# EAGLE design xPi (EAGLE 8.6.0)
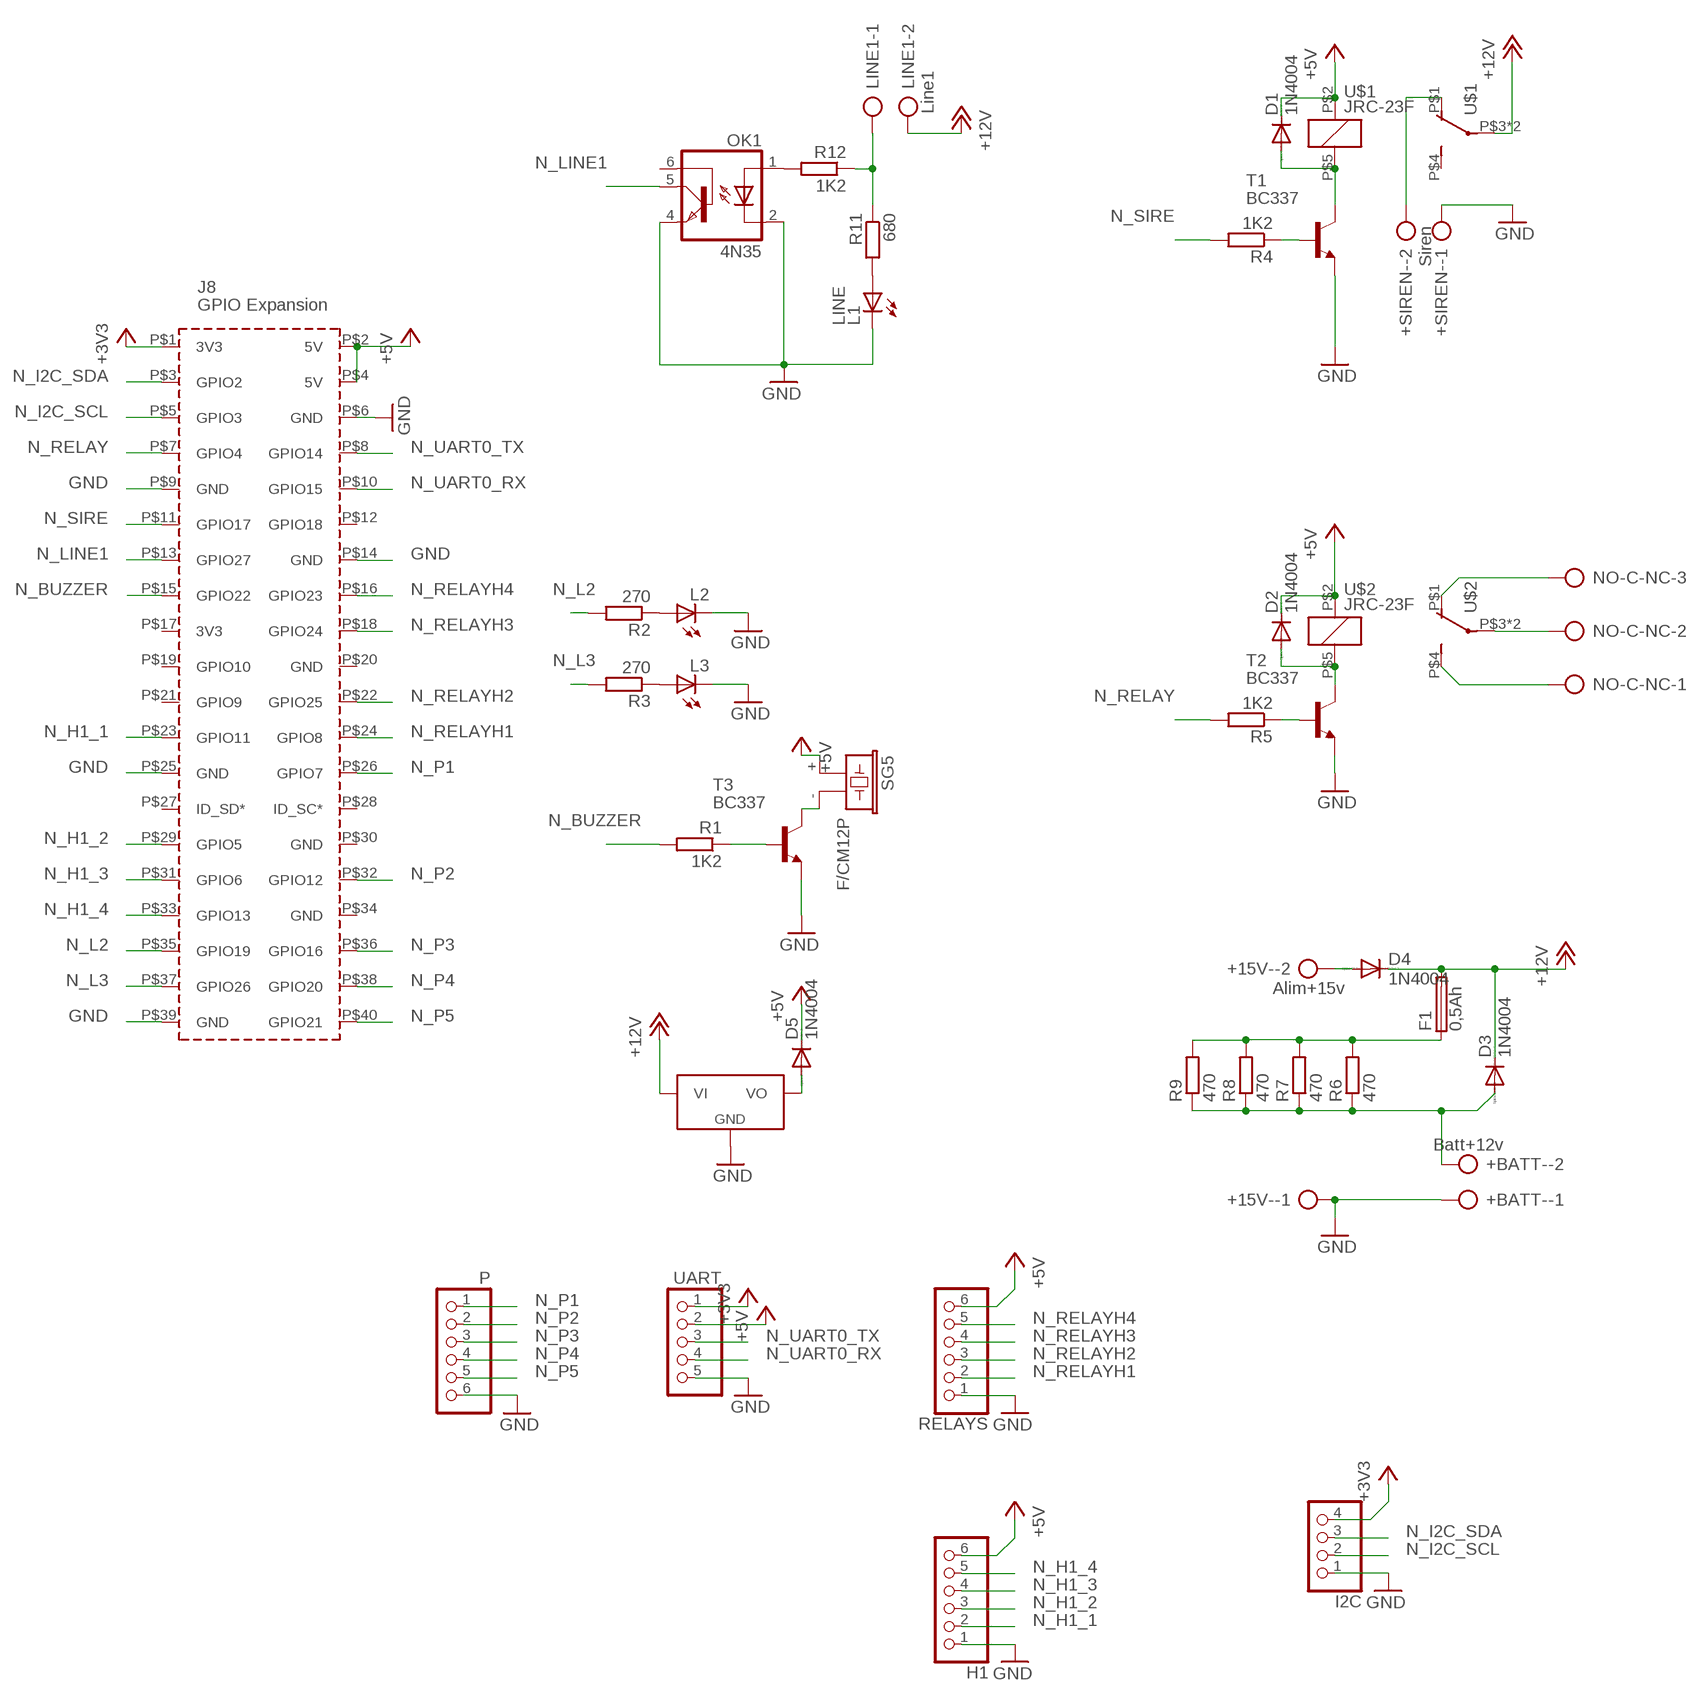
[diagram p0: schematic, sheet 1]

## Parts
+15V-  Alim+15v  AK300/2  [AK300/2]
+BATT-  Batt+12v  AK300/2  [AK300/2]
+SIREN-  Siren  AK300/2  [AK300/2]
D1  1N4004  [DO41-10]
D2  1N4004  [DO41-10]
D3  1N4004  [DO41-10]
D4  1N4004  [DO41-10]
D5  1N4004  [DO41-10]
F1  0,5Ah  FUSEKS9V  [KS9V]
H1  PINHD-1X6  [1X06]
I2C  PINHD-1X4  [1X04]
L1  LINE  LED3MM  [LED3MM]
L2  LED3MM  [LED3MM]
L3  LED3MM  [LED3MM]
LINE1  Line1  AK300/2  [AK300/2]
NO-C-NC  AK300/3  [AK300/3]
OK1  4N35  [DIL06]
P  PINHD-1X6  [1X06]
R1  1K2  R-EU_0204/7  [0204/7]
R2  270  R-EU_0204/7  [0204/7]
R3  270  R-EU_0204/7  [0204/7]
R4  1K2  R-EU_0204/2V  [0204V]
R5  1K2  R-EU_0204/2V  [0204V]
R6  470  R-EU_0204/7  [0204/7]
R7  470  R-EU_0204/7  [0204/7]
R8  470  R-EU_0204/7  [0204/7]
R9  470  R-EU_0204/7  [0204/7]
R11  680  R-EU_0204/7  [0204/7]
R12  1K2  R-EU_0204/7  [0204/7]
RELAYS  PINHD-1X6  [1X06]
SG5  F/CM12P  [F/CM12P]
T1  BC337  [TO92]
T2  BC337  [TO92]
T3  BC337  [TO92]
U$1  JRC-23F  [JRC-23F]
U$2  JRC-23F  [JRC-23F]
U$5  DSWY2596  [DSWY2596]
U$6  RPI3_2  [RPI3_2]
UART  PINHD-1X5  [1X05]

## Nets
+3V3: I2C.4 U$6.P$1(3V3) UART.1
+5V: D1.C D2.C D5.C H1.6 RELAYS.6 SG5.+ U$1.P$2 U$2.P$2 U$6.P$2(5V) U$6.P$4(5V) UART.2
+12V: D3.C D4.C F1.2 LINE1.2 U$1.P$3(P) U$1.P$6(P) U$5.VI
GND: +15V-.1 +BATT-.1 +SIREN-.1 H1.1 I2C.1 L1.K(C) L2.K(C) L3.K(C) OK1.2(C) OK1.4(EMI) P.6 RELAYS.1 T1.1(E) T2.1(E) T3.1(E) U$5.GNDI(GND) U$5.GNDO(GND) U$6.P$6(GND) U$6.P$9(GND) U$6.P$14(GND) U$6.P$25(GND) U$6.P$39(GND) UART.5
N$1: LINE1.1 R11.1 R12.1
N$2: OK1.1(A) R12.2
N$3: R5.1 T2.2(B)
N$4: SG5.- T3.3(C)
N$5: NO-C-NC.1 U$2.P$4(S)
N$6: L2.A R2.1
N$7: R4.1 T1.2(B)
N$8: +15V-.2 D4.A
N$9: D5.A U$5.VO
N$10: R1.1 T3.2(B)
N$11: +SIREN-.2 U$1.P$1(O)
N$12: +BATT-.2 D3.A R6.1 R7.1 R8.1 R9.1
N$13: NO-C-NC.3 U$2.P$1(O)
N$14: NO-C-NC.2 U$2.P$3(P) U$2.P$6(P)
N$15: D2.A T2.3(C) U$2.P$5
N$16: F1.1 R6.2 R7.2 R8.2 R9.2
N$17: D1.A T1.3(C) U$1.P$5
N$21: L1.A R11.2
N$23: L3.A R3.1
N_BUZZER: R1.2 U$6.P$15(GPIO22)
N_H1_1: H1.2 U$6.P$23(GPIO11)
N_H1_2: H1.3 U$6.P$29(GPIO5)
N_H1_3: H1.4 U$6.P$31(GPIO6)
N_H1_4: H1.5 U$6.P$33(GPIO13)
N_I2C_SCL: I2C.2 U$6.P$5(GPIO3)
N_I2C_SDA: I2C.3 U$6.P$3(GPIO2)
N_L2: R2.2 U$6.P$35(GPIO19)
N_L3: R3.2 U$6.P$37(GPIO26)
N_LINE1: OK1.5(COL) U$6.P$13(GPIO27)
N_P1: P.1 U$6.P$26(GPIO7)
N_P2: P.2 U$6.P$32(GPIO12)
N_P3: P.3 U$6.P$36(GPIO16)
N_P4: P.4 U$6.P$38(GPIO20)
N_P5: P.5 U$6.P$40(GPIO21)
N_RELAY: R5.2 U$6.P$7(GPIO4)
N_RELAYH1: RELAYS.2 U$6.P$24(GPIO8)
N_RELAYH2: RELAYS.3 U$6.P$22(GPIO25)
N_RELAYH3: RELAYS.4 U$6.P$18(GPIO24)
N_RELAYH4: RELAYS.5 U$6.P$16(GPIO23)
N_SIRE: R4.2 U$6.P$11(GPIO17)
N_UART0_RX: U$6.P$10(GPIO15) UART.4
N_UART0_TX: U$6.P$8(GPIO14) UART.3
Unconnected: OK1.6(BAS) U$1.P$4(S) U$6.P$12(GPIO18) U$6.P$17(3V3) U$6.P$19(GPIO10) U$6.P$20(GND) U$6.P$21(GPIO9) U$6.P$27(ID_SD*) U$6.P$28(ID_SC*) U$6.P$30(GND) U$6.P$34(GND)

## Library data of the parts
+15V- +BATT- +SIREN- LINE1 = con-ptr500:AK300/2: CONNECTOR; OC_FARNELL: unknown; OC_NEWARK: unknown
D1-D5 = diode:1N4004: DIODE general purpose rectifier, 1 A
F1 = fuse:FUSE: Fuse; OC_FARNELL: unknown; OC_NEWARK: unknown
H1 P RELAYS = pinhead:PINHD-1X6: PIN HEADER
I2C = pinhead:PINHD-1X4: PIN HEADER
L1-L3 = led:LED: LED OSRAM: - CHIPLED LG R971, LG N971, LY N971, LG Q971, LY Q971, LO R971, LY R971 LH N974, LH R974 LS Q976, LO Q976, LY Q976 LO Q996 - Hyper CHIPLED LW Q18S LB Q993, LB Q99A, LB R99A - SideLED LS A670, LO A670, LY A670, LG A670, LP A670 LB A673, LV A673, LT A673, LW A673 LH A674 LY A675 LS A676, LA A676, LO A676, LY A676, LW A676 LS A679, LY A679, LG A679 - Hyper Micro SIDELED® LS Y876, LA Y876, LO Y876, LY Y876 LT Y87S - SmartLED LW L88C, LW L88S LB L89C, LB L89S, LG L890 LS L89K, LO L89K, LY L89K LS L896, LA L896, LO L896, LY L896 - TOPLED LS T670, LO T670, LY T670, LG T670, LP T670 LSG T670, LSP T670, LSY T670, LOP T670, LYG T670 LG T671, LOG T671, LSG T671 LB T673, LV T673, LT T673, LW T673 LH T674 LS T676, LA T676, LO T676, LY T676, LB T676, LH T676, LSB T676, LW T676 LB T67C, LV T67C, LT T67C, LS T67K, LO T67K, LY T67K, LW E67C LS E67B, LA E67B, LO E67B, LY E67B, LB E67C, LV E67C, LT E67C LW T67C LS T679, LY T679, LG T679 LS T770, LO T770, LY T770, LG T770, LP T770 LB T773, LV T773, LT T773, LW T773 LH T774 LS E675, LA E675, LY E675, LS T675 LS T776, LA T776, LO T776, LY T776, LB T776 LHGB T686 LT T68C, LB T68C - Hyper Mini TOPLED® LB M676 - Mini TOPLED Santana® LG M470 LS M47K, LO M47K, LY M47K Source: http://www.osram.convergy.de LUXEON: - LUMILED® LXK2-PW12-R00, LXK2-PW12-S00, LXK2-PW14-U00, LXK2-PW14-V00 LXK2-PM12-R00, LXK2-PM12-S00, LXK2-PM14-U00 LXK2-PE12-Q00, LXK2-PE12-R00, LXK2-PE12-S00, LXK2-PE14-T00, LXK2-PE14-U00 LXK2-PB12-K00, LXK2-PB12-L00, LXK2-PB12-M00, LXK2-PB14-N00, LXK2-PB14-P00, LXK2-PB14-Q00 LXK2-PR12-L00, LXK2-PR12-M00, LXK2-PR14-Q00, LXK2-PR14-R00 LXK2-PD12-Q00, LXK2-PD12-R00, LXK2-PD12-S00 LXK2-PH12-R00, LXK2-PH12-S00 LXK2-PL12-P00, LXK2-PL12-Q00, LXK2-PL12-R00 Source: www.luxeon.com KINGBRIGHT: KA-3528ASYC Source: www.kingbright.com
NO-C-NC = con-ptr500:AK300/3: CONNECTOR; OC_FARNELL: unknown; OC_NEWARK: unknown
OK1 = optocoupler:4N35: MOTOROLA OPTO COUPLER; MF: FAIRCHILD SEMICONDUCTOR; MPN: 4N35; OC_FARNELL: 1328375; OC_NEWARK: 72K9946
R1-R5 R11 R12 = resistor:R-EU_: RESISTOR, European symbol
R6-R9 = rcl:R-EU_: RESISTOR, European symbol; SPICEPREFIX: R
SG5 = buzzer:F/CM12P: BUZZER Source: Buerklin; OC_FARNELL: unknown; OC_NEWARK: unknown
T1-T3 = transistor:BC337: NPN TRANSISTOR
U$1 U$2 = JRC-23F:JRC-23F
U$5 = DSWY2596:DSWY2596
U$6 = e14_Rpi3_RevA+mirror-pcb:RPI3_2
UART = pinhead:PINHD-1X5: PIN HEADER

## Board
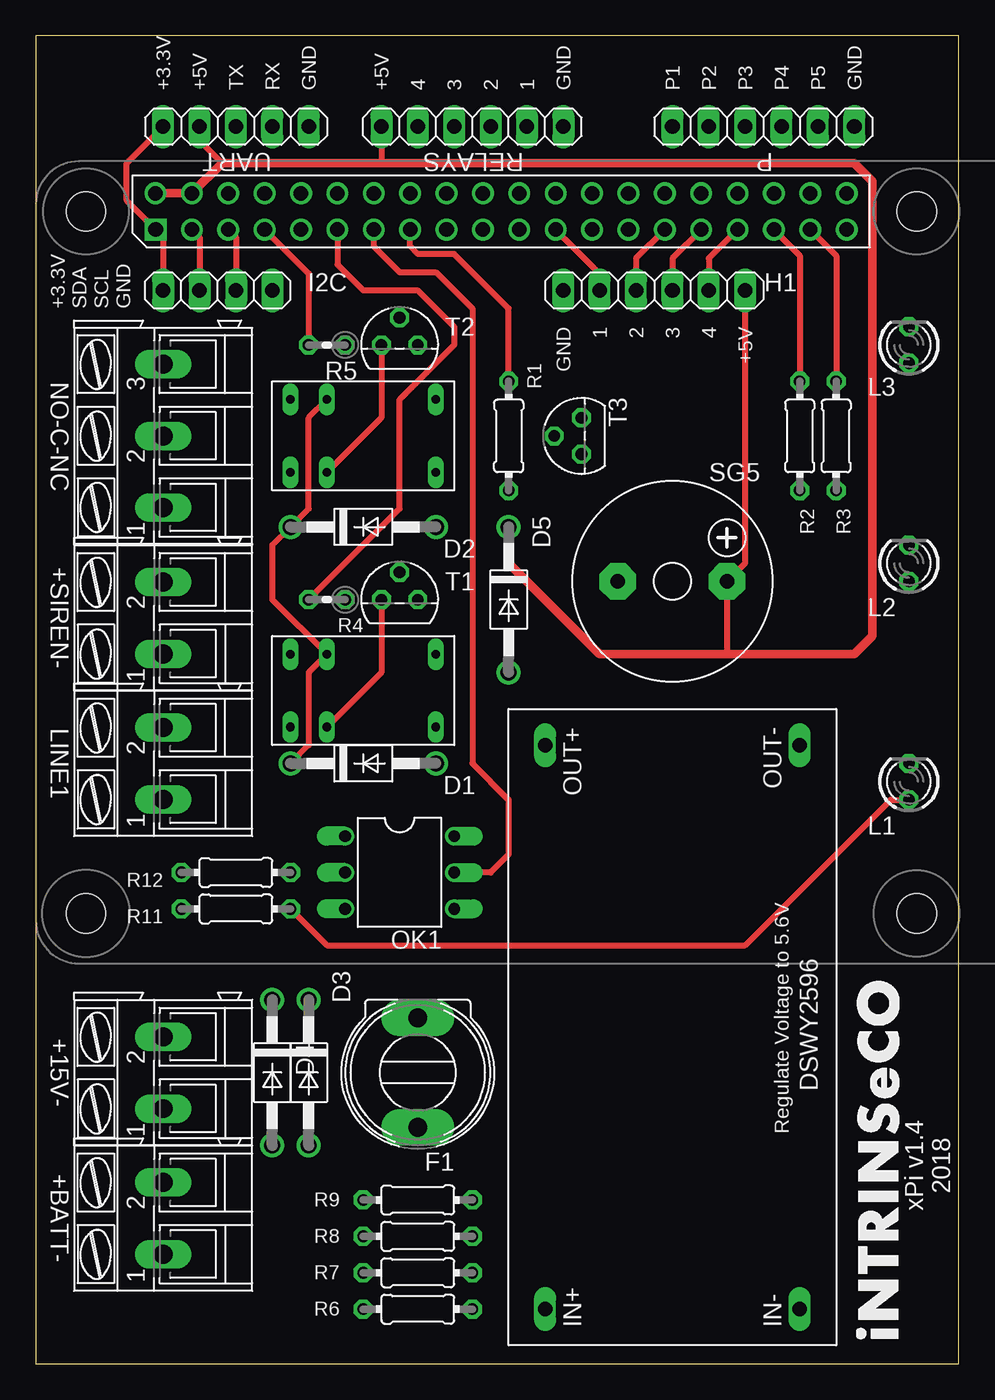
[diagram p1: board, top side]
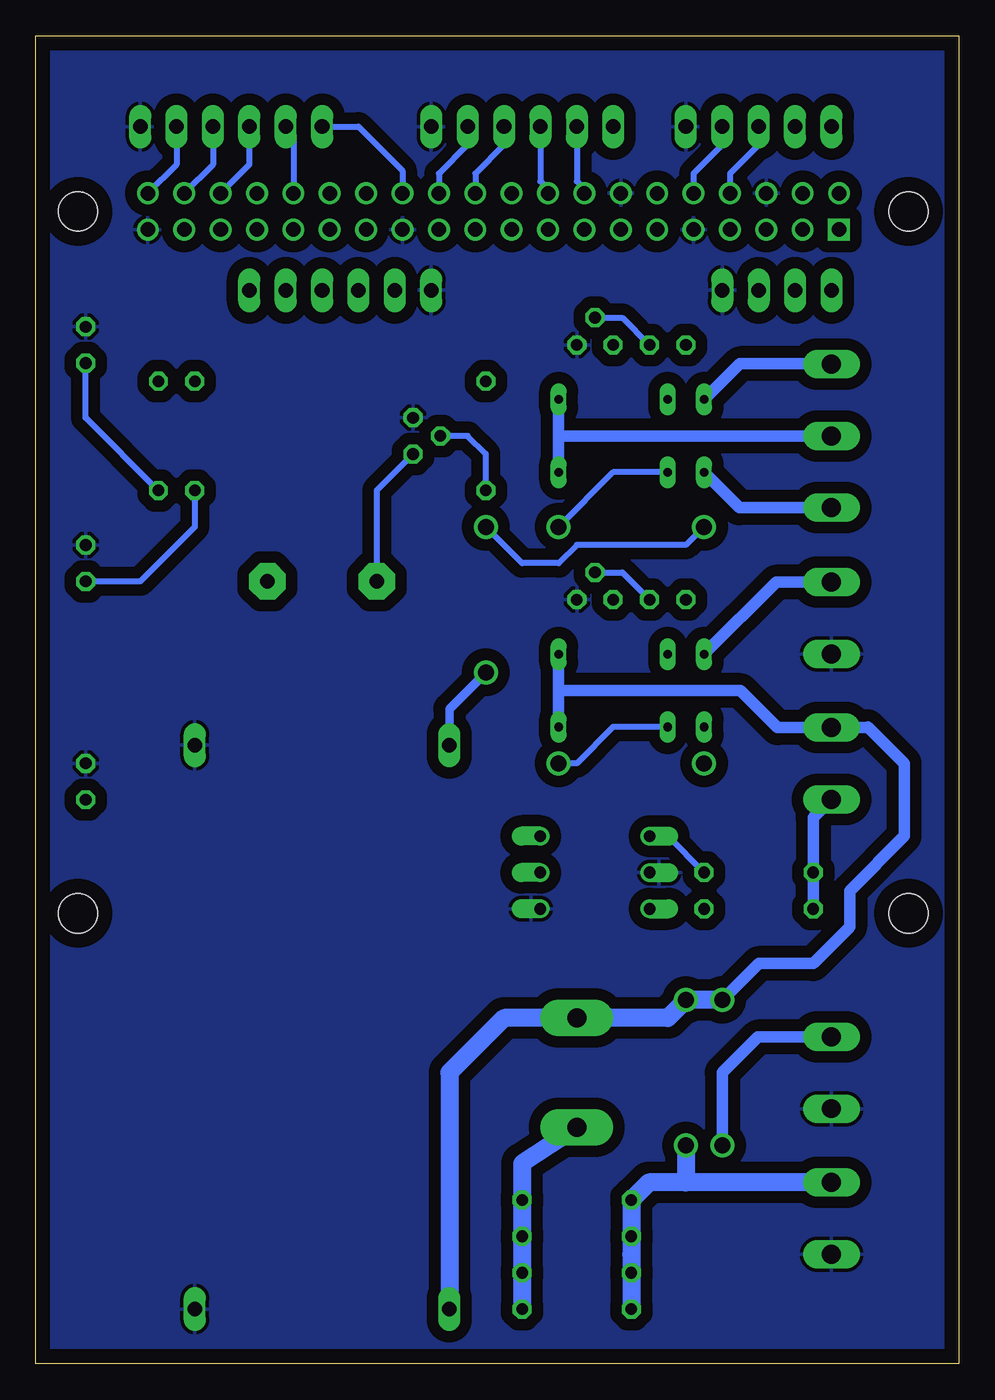
[diagram p2: board, bottom side, seen from below]

Size 64.44 x 92.7 mm. Coordinates in mm from the lower left corner, seen from the top.
Outline: 0,0 64.44,0 64.44,92.7 0,92.7 0,0
Copper layers (1*16): Top 0.035mm / dielectric 1.5mm / Bottom 0.035mm
Design rules "default *": minimum track width 6mil, minimum drill 0.35mm, track to track 6mil, track to pad 6mil, pad to pad 6mil, via to via 6mil, smd to smd 6mil, copper to edge 40mil, drill to drill 6mil, minimum pad ring 10mil, minimum via ring 8mil, stop-mask expansion 4mil, vias tented up to drill 0mil, thermal gap 10mil

### Footprints (pad centres in the part's own frame; a part is rotated, then mirrored left to right if it is on the bottom)
AK300/2 = drill 1.321 long: 1 -2.515,0; 2 2.489,0
DO41-10 = drill 1.118: A 5.08,0; C -5.08,0
KS9V = drill 1.321 pad 2.54 long: 1 0,3.81; 2 0,-3.81
1X06 = drill 1.016 long: 1 -6.35,0; 2 -3.81,0; 3 -1.27,0; 4 1.27,0; 5 3.81,0; 6 6.35,0
1X04 = drill 1.016 long: 1 -3.81,0; 2 -1.27,0; 3 1.27,0; 4 3.81,0
LED3MM = drill 0.813 octagon: A -1.27,0; K 1.27,0
AK300/3 = drill 1.321 long: 1 -5.004,0; 2 0,0; 3 5.004,0
DIL06 = drill 0.813 offset: 1 -2.54,-3.81; 2 0,-3.81; 3 2.54,-3.81; 4 2.54,3.81; 5 0,3.81; 6 -2.54,3.81
0204/7 = drill 0.813 octagon: 1 -3.81,0; 2 3.81,0
0204V = drill 0.813 octagon: 1 -1.27,0; 2 1.27,0
F/CM12P = drill 1.016 pad 2.54 octagon: + 3.81,0; - -3.81,0
TO92 = drill 0.813 octagon: 1 1.27,0; 2 0,1.905; 3 -1.27,0
JRC-23F = drill 0.6 long: P$1 0,0; P$2 2.54,0; P$3 10.16,0; P$4 0,-5.08; P$5 2.54,-5.08; P$6 10.16,-5.08
DSWY2596 = drill 1.016 long: GNDI 0,0; GNDO 39.37,0; VI 0,17.78; VO 39.37,17.78
RPI3_2 = drill 1.016 square: P$1 8.37,51.23 | drill 1.016: P$2 8.357,53.772; P$3 10.897,51.232; P$4 10.897,53.772; P$5 13.437,51.232; P$6 13.437,53.772; P$7 15.977,51.232; P$8 15.977,53.772; P$9 18.517,51.232; P$10 18.517,53.772; P$11 21.057,51.232; P$12 21.057,53.772; P$13 23.597,51.232; P$14 23.597,53.772; P$15 26.137,51.232; P$16 26.137,53.772; P$17 28.677,51.232; P$18 28.677,53.772; P$19 31.217,51.232; P$20 31.217,53.772; P$21 33.757,51.232; P$22 33.757,53.772; P$23 36.297,51.232; P$24 36.297,53.772; P$25 38.837,51.232; P$26 38.837,53.772; P$27 41.377,51.232; P$28 41.377,53.772; P$29 43.917,51.232; P$30 43.917,53.772; P$31 46.457,51.232; P$32 46.457,53.772; P$33 48.997,51.232; P$34 48.997,53.772; P$35 51.537,51.232; P$36 51.537,53.772; P$37 54.077,51.232; P$38 54.077,53.772; P$39 56.617,51.232; P$40 56.617,53.772 | hole 2.75: 3.5,3.5; 61.5,3.5; 3.5,52.5; 61.5,52.5
1X05 = drill 1.016 long: 1 -5.08,0; 2 -2.54,0; 3 0,0; 4 2.54,0; 5 5.08,0

### Placement (x,y rotation side)
+15V-  8.89,20.32 90 top
+BATT-  8.89,10.16 90 top
+SIREN-  8.89,52.07 90 top
D1  22.86,41.91 0 top
D2  22.86,58.42 0 top
D3  19.05,20.32 270 top
D4  16.51,20.32 270 top
D5  33.02,53.34 270 top
F1  26.67,20.32 180 top
H1  43.18,74.93 0 top
I2C  12.7,74.93 180 top
L1  60.96,40.64 90 top
L2  60.96,55.88 90 top
L3  60.96,71.12 90 top
LINE1  8.89,41.91 90 top
NO-C-NC  8.89,64.77 90 top
OK1  25.4,34.29 270 top
P  50.8,86.36 0 top
R1  33.02,64.77 90 top
R2  53.34,64.77 90 top
R3  55.88,64.77 90 top
R4  20.32,53.34 180 top
R5  20.32,71.12 180 top
R6  26.67,3.81 0 top
R7  26.67,6.35 0 top
R8  26.67,8.89 0 top
R9  26.67,11.43 0 top
R11  13.97,31.75 0 top
R12  13.97,34.29 0 top
RELAYS  30.48,86.36 180 top
SG5  44.45,54.61 0 top
T1  25.4,53.34 0 top
T2  25.4,71.12 0 top
T3  38.1,64.77 90 top
U$1  17.78,49.53 0 top
U$2  17.78,67.31 0 top
U$5  53.34,3.81 90 top
U$6  0,27.94 0 top
UART  13.97,86.36 0 top

### Tracks (layer width: path | path; a pad name or v marks a point on that pad's centre or on a via)
+3V3
  Top 0.406: UART.1 6.35,83.82 6.35,81.19 U$6.P$1 8.89,78.65 I2C.4
+5V
  Top 0.406: U$2.P$2 19.05,66.04 19.05,59.69 D2.C 16.51,57.15 16.51,53.34 U$1.P$2 19.05,48.26 19.05,43.18 D1.C | RELAYS.6 24.13,83.82 | H1.6 49.53,55.88 SG5.+ 48.26,49.53 | UART.2 11.43,85.39 13.01,83.82
  Top 0.61: U$6.P$2 U$6.P$4 13.01,83.82 24.13,83.82 57.15,83.82 58.42,82.55 58.42,50.8 57.15,49.53 48.26,49.53 39.37,49.53 33.02,55.88 D5.C
  Bottom 0.406: D2.C 19.05,57.15 26.67,57.15 27.94,55.88 30.48,55.88 D5.C
+12V
  Bottom 0.813: U$1.P$6 27.94,46.99 | 27.94,46.99 U$1.P$3 | 27.94,46.99 15.24,46.99 12.65,44.4 LINE1.2 6.4,44.4 6.35,44.45 3.81,41.91 3.81,36.83 7.62,33.02 7.62,30.48 10.16,27.94 13.97,27.94 D4.C
  Bottom 1.27: U$5.VI 35.56,20.32 31.75,24.13 F1.2 20.32,24.13 D3.C D4.C
GND
  pour Bottom (isolate 0.813): -3.81,97.79 88.9,97.79 88.9,-2.54 -3.81,-2.54
N$1
  Bottom 0.813: LINE1.1 10.16,38.12 R12.1 R11.1
N$2
  Bottom 0.406: R12.2 20.32,36.83 OK1.1
N$3
  Bottom 0.406: T2.2 23.5,73.03 R5.1
N$4
  Bottom 0.406: T3.3 40.64,60.96 SG5.-
N$5
  Bottom 0.813: NO-C-NC.1 15.32,59.77 U$2.P$4
N$6
  Bottom 0.406: R2.1 53.34,58.42 57.15,54.61 L2.A
N$7
  Bottom 0.406: T1.2 23.5,55.24 R4.1
N$8
  Bottom 0.813: +15V-.2 14.02,22.81 16.51,20.32 D4.A
N$9
  Bottom 0.61: D5.A 35.56,45.72 U$5.VO
N$10
  Bottom 0.406: R1.1 33.02,63.5 34.29,64.77 T3.2
N$11
  Bottom 0.813: +SIREN-.2 12.75,54.56 U$1.P$1
N$12
  Bottom 1.27: R6.1 R7.1 22.86,7.62 R8.1 R9.1 21.64,12.65 19.05,12.65 | +BATT-.2 19.05,12.65 | D3.A 19.05,12.65
N$13
  Bottom 0.813: U$2.P$1 15.28,69.81 8.93,69.81 NO-C-NC.3
N$14
  Bottom 0.813: U$2.P$6 U$2.P$3 | 27.9,67.35 U$2.P$3 | NO-C-NC.2 27.94,64.77 U$2.P$3
N$15
  Top 0.406: T2.3 24.13,66.04 U$2.P$5
  Bottom 0.406: U$2.P$5 24.13,62.23 D2.A
N$16
  Bottom 1.27: F1.1 30.48,13.97 R9.2 R8.2 R7.2 R6.2
N$17
  Top 0.406: T1.3 24.13,48.26 U$1.P$5
  Bottom 0.406: U$1.P$5 24.13,44.45 26.67,41.91 D1.A
N$21
  Top 0.406: R11.2 20.32,29.21 49.53,29.21 59.69,39.37 L1.A
N$23
  Bottom 0.406: R3.1 60.96,66.04 L3.A
N_BUZZER
  Top 0.406: U$6.P$15 26.14,78 26.67,77.47 29.21,77.47 33.02,73.66 R1.2
N_H1_1
  Top 0.406: U$6.P$23 39.37,76.1 H1.2
N_H1_2
  Top 0.406: U$6.P$29 41.91,77.17 H1.3
N_H1_3
  Top 0.406: U$6.P$31 44.45,77.17 H1.4
N_H1_4
  Top 0.406: U$6.P$33 46.99,77.17 H1.5
N_I2C_SCL
  Top 0.406: U$6.P$5 13.97,78.64 I2C.2
N_I2C_SDA
  Top 0.406: U$6.P$3 11.43,78.64 I2C.3
N_L2
  Top 0.406: U$6.P$35 53.34,77.37 R2.2
N_L3
  Top 0.406: U$6.P$37 55.88,77.37 R3.2
N_LINE1
  Top 0.406: U$6.P$13 23.6,78 25.4,76.2 27.94,76.2 30.48,73.66 30.48,41.91 33.02,39.37 33.02,35.56 31.75,34.29 OK1.5
N_P1
  Bottom 0.406: P.1 41.91,86.36 38.84,83.29 U$6.P$26
N_P2
  Bottom 0.406: P.2 46.46,85.83 U$6.P$32
N_P3
  Bottom 0.406: P.3 49.53,83.72 U$6.P$36
N_P4
  Bottom 0.406: P.4 52.07,83.72 U$6.P$38
N_P5
  Bottom 0.406: U$6.P$40 54.61,83.72 P.5
N_RELAY
  Top 0.406: U$6.P$7 19.05,76.1 R5.2
N_RELAYH1
  Bottom 0.406: RELAYS.2 34.29,85.09 36.3,83.08 U$6.P$24
N_RELAYH2
  Bottom 0.406: RELAYS.3 31.75,85.09 33.76,83.08 U$6.P$22
N_RELAYH3
  Bottom 0.406: RELAYS.4 29.21,82.55 28.68,82.02 U$6.P$18
N_RELAYH4
  Bottom 0.406: RELAYS.5 26.67,82.55 26.14,82.02 U$6.P$16
N_SIRE
  Top 0.406: U$6.P$11 21.06,76.73 22.86,74.93 26.67,74.93 29.21,72.39 29.21,71.12 25.4,67.31 25.4,59.69 R4.2
N_UART0_RX
  Bottom 0.406: UART.4 16.51,85.09 18.52,83.08 U$6.P$10
N_UART0_TX
  Bottom 0.406: UART.3 13.97,85.09 15.98,83.08 U$6.P$8

### Text on the board
tNames: +3.3V | +5V | TX | RX | GND | +5V | 4 | 3 | 2 | 1 | GND | P1 | P2 | P3 | P4 | P5 | GND | +3.3V / SDA / SCL / GND | GND | 1 | 2 | 3 | 4 | +5V | Regulate Voltage to 5.6V | xPi v1.4 / 2018